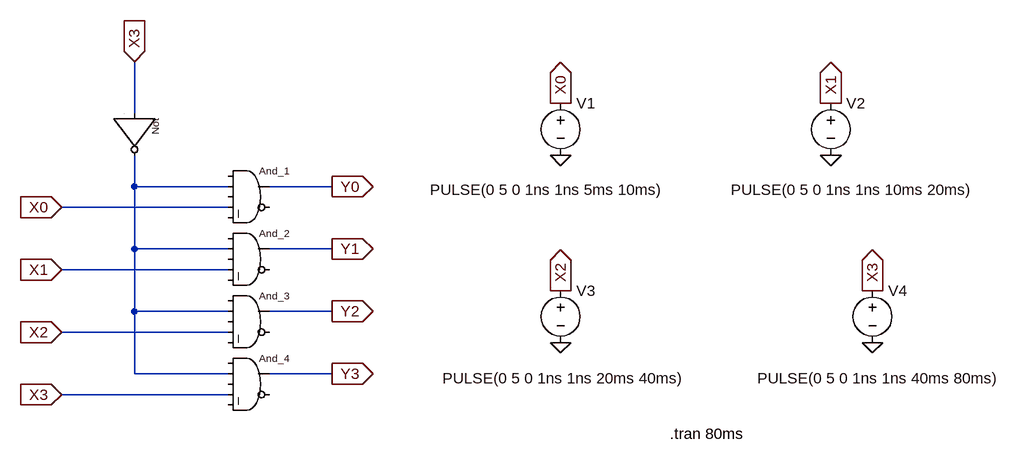
[diagram p0: schematic P1_ReLU.asc]
P1_ReLU.asc, the LTspice schematic file:
Version 4
SHEET 1 1604 712
WIRE 224 16 224 -64
WIRE 224 128 224 80
WIRE 368 128 224 128
WIRE 528 128 432 128
WIRE 368 160 112 160
WIRE 224 224 224 128
WIRE 368 224 224 224
WIRE 528 224 432 224
WIRE 368 256 112 256
WIRE 224 320 224 224
WIRE 368 320 224 320
WIRE 528 320 432 320
WIRE 368 352 112 352
WIRE 224 416 224 320
WIRE 368 416 224 416
WIRE 528 416 432 416
WIRE 368 448 112 448
FLAG 112 160 X0
IOPIN 112 160 In
FLAG 112 256 X1
IOPIN 112 256 In
FLAG 112 352 X2
IOPIN 112 352 In
FLAG 112 448 X3
IOPIN 112 448 In
FLAG 224 -64 X3
IOPIN 224 -64 In
FLAG 528 128 Y0
IOPIN 528 128 Out
FLAG 528 224 Y1
IOPIN 528 224 Out
FLAG 528 320 Y2
IOPIN 528 320 Out
FLAG 528 416 Y3
IOPIN 528 416 Out
FLAG 880 80 0
FLAG 1296 80 0
FLAG 880 368 0
FLAG 1360 368 0
FLAG 880 0 X0
IOPIN 880 0 Out
FLAG 1296 0 X1
IOPIN 1296 0 Out
FLAG 880 288 X2
IOPIN 880 288 Out
FLAG 1360 288 X3
IOPIN 1360 288 Out
SYMBOL Digital\\and 400 80 R0
WINDOW 0 16 24 Left 1
SYMATTR InstName And_1
SYMBOL Digital\\and 400 176 R0
WINDOW 0 16 24 Left 1
SYMATTR InstName And_2
SYMBOL Digital\\and 400 272 R0
WINDOW 0 16 24 Left 1
SYMATTR InstName And_3
SYMBOL Digital\\and 400 368 R0
WINDOW 0 16 24 Left 1
SYMATTR InstName And_4
SYMBOL Digital\\inv 288 16 R90
WINDOW 0 8 32 Left 1
SYMATTR InstName Not
SYMBOL voltage 880 -16 R0
WINDOW 3 -201 149 Left 2
WINDOW 123 0 0 Left 0
WINDOW 39 0 0 Left 0
SYMATTR Value PULSE(0 5 0 1ns 1ns 5ms 10ms)
SYMATTR InstName V1
SYMBOL voltage 1296 -16 R0
WINDOW 3 -154 149 Left 2
WINDOW 123 0 0 Left 0
WINDOW 39 0 0 Left 0
SYMATTR Value PULSE(0 5 0 1ns 1ns 10ms 20ms)
SYMATTR InstName V2
SYMBOL voltage 880 272 R0
WINDOW 3 -182 151 Left 2
WINDOW 123 0 0 Left 0
WINDOW 39 0 0 Left 0
SYMATTR Value PULSE(0 5 0 1ns 1ns 20ms 40ms)
SYMATTR InstName V3
SYMBOL voltage 1360 272 R0
WINDOW 3 -177 151 Left 2
WINDOW 123 0 0 Left 0
WINDOW 39 0 0 Left 0
SYMATTR Value PULSE(0 5 0 1ns 1ns 40ms 80ms)
SYMATTR InstName V4
TEXT 1048 508 Left 2 !.tran 80ms

The netlist it stands for:
* P1_ReLU.asc
And_1 0 N001 0 X0 0 0 Y0 0 AND
And_2 0 N001 0 X1 0 0 Y1 0 AND
And_3 0 N001 0 X2 0 0 Y2 0 AND
And_4 0 N001 0 X3 0 0 Y3 0 AND
A§Not X3 0 0 0 0 N001 0 0 BUF
V1 X0 0 PULSE(0 5 0 1ns 1ns 5ms 10ms)
V2 X1 0 PULSE(0 5 0 1ns 1ns 10ms 20ms)
V3 X2 0 PULSE(0 5 0 1ns 1ns 20ms 40ms)
V4 X3 0 PULSE(0 5 0 1ns 1ns 40ms 80ms)
.tran 80ms
.backanno
.end